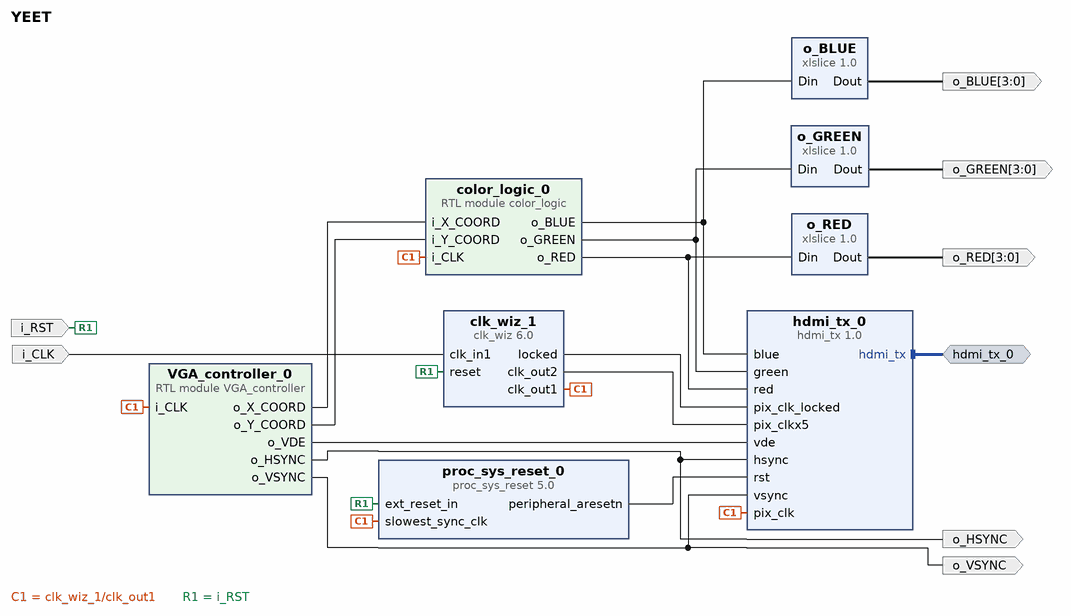
[diagram p0: block diagram of the top level]
# Vivado block design YEET, xc7z007sclg400-1, Vivado 2018.2
create_bd_design YEET

create_bd_intf_port -mode Master -vlnv xilinx.com:interface:hdmi_rtl:2.0 hdmi_tx_0
create_bd_port -dir O o_HSYNC
create_bd_port -dir O o_VSYNC
create_bd_port -dir I -type clk i_CLK
set_property -dict {CONFIG.FREQ_HZ 100000000} [get_bd_ports i_CLK]
create_bd_port -dir I -type rst i_RST
set_property -dict {CONFIG.POLARITY ACTIVE_HIGH} [get_bd_ports i_RST]
create_bd_port -dir O -from 3 -to 0 o_GREEN
create_bd_port -dir O -from 3 -to 0 o_RED
create_bd_port -dir O -from 3 -to 0 o_BLUE

create_bd_cell -type module -reference VGA_controller VGA_controller_0
create_bd_cell -type ip -vlnv xilinx.com:ip:clk_wiz:6.0 clk_wiz_1
set_property -dict [list \
  CONFIG.CLKOUT2_USED true \
  CONFIG.NUM_OUT_CLKS 2 \
  CONFIG.CLKOUT1_REQUESTED_OUT_FREQ 25 \
  CONFIG.CLKOUT2_REQUESTED_OUT_FREQ 125 \
  CONFIG.MMCM_DIVCLK_DIVIDE 1 \
  CONFIG.MMCM_CLKFBOUT_MULT_F 10.000 \
  CONFIG.MMCM_CLKOUT0_DIVIDE_F 40.000 \
  CONFIG.MMCM_CLKOUT1_DIVIDE 8 \
  CONFIG.CLKOUT1_JITTER 175.402 \
  CONFIG.CLKOUT1_PHASE_ERROR 98.575 \
  CONFIG.CLKOUT2_JITTER 125.247 \
  CONFIG.CLKOUT2_PHASE_ERROR 98.575 \
] [get_bd_cells clk_wiz_1]
create_bd_cell -type ip -vlnv xilinx.com:ip:proc_sys_reset:5.0 proc_sys_reset_0
create_bd_cell -type ip -vlnv xilinx.com:ip:xlslice:1.0 o_RED
set_property -dict {CONFIG.DIN_TO 0 CONFIG.DIN_FROM 3 CONFIG.DIN_WIDTH 8 CONFIG.DOUT_WIDTH 4} [get_bd_cells o_RED]
create_bd_cell -type ip -vlnv xilinx.com:ip:xlslice:1.0 o_GREEN
set_property -dict {CONFIG.DIN_TO 0 CONFIG.DIN_FROM 3 CONFIG.DIN_WIDTH 8 CONFIG.DOUT_WIDTH 4} [get_bd_cells o_GREEN]
create_bd_cell -type ip -vlnv xilinx.com:ip:xlslice:1.0 o_BLUE
set_property -dict {CONFIG.DIN_TO 0 CONFIG.DIN_FROM 3 CONFIG.DIN_WIDTH 8 CONFIG.DOUT_WIDTH 4} [get_bd_cells o_BLUE]
create_bd_cell -type ip -vlnv realdigital.org:realdigital:hdmi_tx:1.0 hdmi_tx_0
set_property -dict {CONFIG.MODE HDMI} [get_bd_cells hdmi_tx_0]
create_bd_cell -type module -reference color_logic color_logic_0

# ---- connections ----

connect_bd_intf_net [get_bd_intf_ports hdmi_tx_0] [get_bd_intf_pins hdmi_tx_0/hdmi_tx]
connect_bd_net [get_bd_pins VGA_controller_0/o_HSYNC] [get_bd_ports o_HSYNC] [get_bd_pins hdmi_tx_0/hsync]
connect_bd_net [get_bd_pins VGA_controller_0/o_VSYNC] [get_bd_ports o_VSYNC] [get_bd_pins hdmi_tx_0/vsync]
connect_bd_net [get_bd_pins VGA_controller_0/o_VDE] [get_bd_pins hdmi_tx_0/vde]
connect_bd_net [get_bd_pins VGA_controller_0/o_X_COORD] [get_bd_pins color_logic_0/i_X_COORD]
connect_bd_net [get_bd_pins VGA_controller_0/o_Y_COORD] [get_bd_pins color_logic_0/i_Y_COORD]
connect_bd_net [get_bd_pins color_logic_0/o_RED] [get_bd_pins o_RED/Din] [get_bd_pins hdmi_tx_0/red]
connect_bd_net [get_bd_pins color_logic_0/o_GREEN] [get_bd_pins o_GREEN/Din] [get_bd_pins hdmi_tx_0/green]
connect_bd_net [get_bd_pins color_logic_0/o_BLUE] [get_bd_pins o_BLUE/Din] [get_bd_pins hdmi_tx_0/blue]
connect_bd_net -net clk_wiz_0_clk_out1 [get_bd_pins clk_wiz_1/clk_out1] \
  [get_bd_pins VGA_controller_0/i_CLK] [get_bd_pins proc_sys_reset_0/slowest_sync_clk] [get_bd_pins hdmi_tx_0/pix_clk] \
  [get_bd_pins color_logic_0/i_CLK]
connect_bd_net -net clk_wiz_0_locked [get_bd_pins clk_wiz_1/locked] [get_bd_pins hdmi_tx_0/pix_clk_locked]
connect_bd_net -net clk_wiz_0_clk_out2 [get_bd_pins clk_wiz_1/clk_out2] [get_bd_pins hdmi_tx_0/pix_clkx5]
connect_bd_net -net clk_100MHz_1 [get_bd_ports i_CLK] [get_bd_pins clk_wiz_1/clk_in1]
connect_bd_net -net reset_rtl_0_1 [get_bd_ports i_RST] [get_bd_pins clk_wiz_1/reset] [get_bd_pins proc_sys_reset_0/ext_reset_in]
connect_bd_net [get_bd_pins proc_sys_reset_0/peripheral_aresetn] [get_bd_pins hdmi_tx_0/rst]
connect_bd_net [get_bd_pins o_GREEN/Dout] [get_bd_ports o_GREEN]
connect_bd_net [get_bd_pins o_RED/Dout] [get_bd_ports o_RED]
connect_bd_net [get_bd_pins o_BLUE/Dout] [get_bd_ports o_BLUE]

validate_bd_design
save_bd_design
